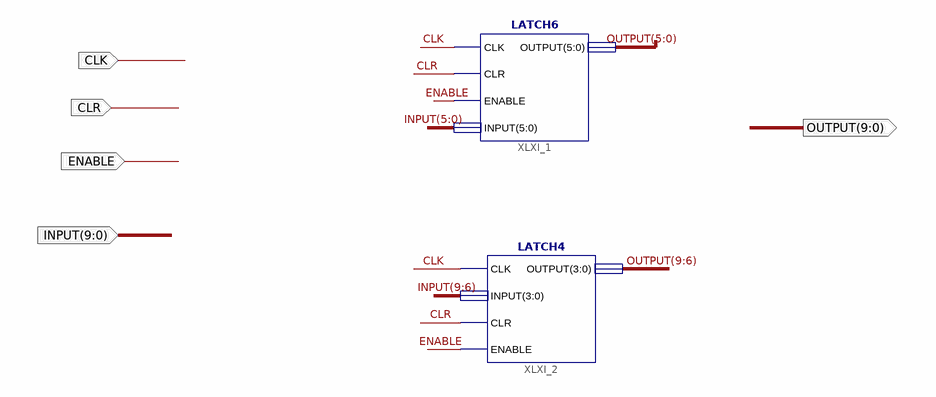
[diagram p0: schematic sheet 1]
// Xilinx ISE schematic LATCH10.sch (artix7) as structural Verilog: 2 symbols, 5 ports
module LATCH10 (
  input  CLK,
  input  CLR,
  input  ENABLE,
  input  [9:0] INPUT,
  output [9:0] OUTPUT
);

  LATCH6 XLXI_1 (.CLK(CLK), .CLR(CLR), .ENABLE(ENABLE), .INPUT(INPUT[5:0]), .OUTPUT(OUTPUT[5:0]));
  LATCH4 XLXI_2 (.CLK(CLK), .INPUT(INPUT[9:6]), .CLR(CLR), .ENABLE(ENABLE), .OUTPUT(OUTPUT[9:6]));
endmodule
